# EAGLE design microNrf (EAGLE 9.6.2)
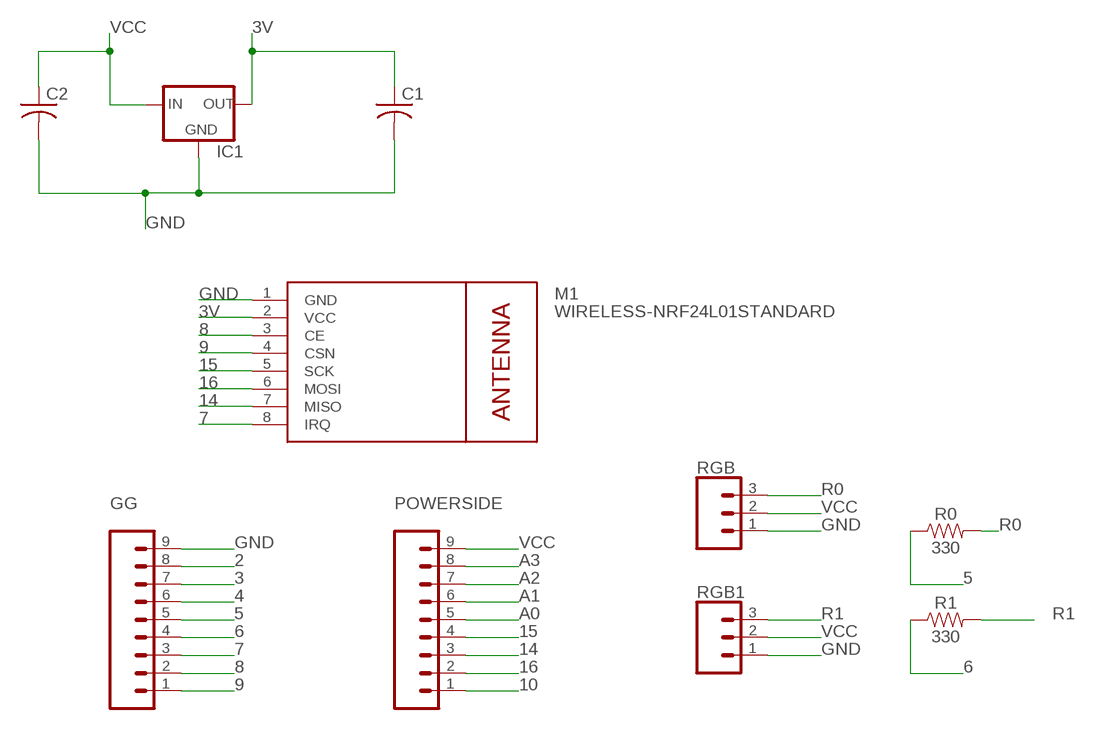
[diagram p0: schematic, sheet 1]

## Parts
C1  C-US025-030X050  [C025-030X050]
C2  C-US025-030X050  [C025-030X050]
GG  CONN_09  [1X09]
IC1  MCP1700TRI  [TO92]
M1  WIRELESS-NRF24L01STANDARD  [WIRELESS-NRF24L01]
POWERSIDE  CONN_09  [1X09]
R0  330  330OHM-0603-1/10W-1%  [0603]
R1  330  330OHM-0603-1/10W-1%  [0603]
RGB  CONN_03LONGPADS  [1X03_LONGPADS]
RGB1  CONN_03LONGPADS  [1X03_LONGPADS]

## Nets
2: GG.8
3: GG.7
3V: C1.1 IC1.3(OUT) M1.2(VCC)
4: GG.6
5: GG.5 R0.1
6: GG.4 R1.1
7: GG.3 M1.8(IRQ)
8: GG.2 M1.3(CE)
9: GG.1 M1.4(CSN)
10: POWERSIDE.1
14: M1.7(MISO) POWERSIDE.3
15: M1.5(SCK) POWERSIDE.4
16: M1.6(MOSI) POWERSIDE.2
A0: POWERSIDE.5
A1: POWERSIDE.6
A2: POWERSIDE.7
A3: POWERSIDE.8
GND: C1.2 C2.2 GG.9 IC1.1(GND) M1.1(GND) RGB1.1 RGB.1
R0: R0.2 RGB.3
R1: R1.2 RGB1.3
VCC: C2.1 IC1.2(IN) POWERSIDE.9 RGB1.2 RGB.2

## Library data of the parts
C1 C2 = adafruit:C-US: CAPACITOR, American symbol
GG POWERSIDE = SparkFun-Connectors:CONN_09: Multi connection point. Often used as Generic Header-pin footprint for 0.1 inch spaced/style header connections On any of the 0.1 inch spaced packages, you can populate with these: Break Away Headers - Straight <https://www.sparkfun.com/products/116> (PRT-00116) Break Away Male Headers - Right Angle <https://www.sparkfun.com/products/553> (PRT-00553) Female Headers <https://www.sparkfun.com/products/115> (PRT-00115) Break Away Headers - Machine Pin <https://www.sparkfun.com/products/117> (PRT-00117) Break Away Female Headers - Swiss Machine Pin <https://www.sparkfun.com/products/743> (PRT-00743) For SCREWTERMINALS and SPRING TERMINALS visit here: Screw Terimnals on SparkFun.com <https://www.sparkfun.com/search/results?term=Screw+Terminals> (5mm/3.5mm/2.54mm spacing) This device is also useful as a general connection point to wire up your design to another part of your project. Our various solder wires solder well into these plated through hole pads. Hook-Up Wire - Assortment (Stranded, 22 AWG) <https://www.sparkfun.com/products/11375> (PRT-11375) Hook-Up Wire - Assortment (Solid Core, 22 AWG) <https://www.sparkfun.com/products/11367> (PRT-11367) View the entire wire category on our website here <https://www.sparkfun.com/categories/141> Special notes: Molex polarized connector foot print use with SKU : PRT-08231 with associated crimp pins and housings. 1MM SMD Version SKU: PRT-10208 NOTES ON THE VARIANTS LOCK and LOCK_LONGPADS... This footprint was designed to help hold the alignment of a through-hole component (i.e. 6-pin header) while soldering it into place. You may notice that each hole has been shifted either up or down by 0.005 of an inch from it's more standard position (which is a perfectly straight line). This slight alteration caused the pins (the squares in the middle) to touch the edges of the holes. Because they are alternating, it causes a "brace" to hold the component in place. 0.005 has proven to be the perfect amount of "off-center" position when using our standard breakaway headers. Although looks a little odd when you look at the bare footprint, once you have a header in there, the alteration is very hard to notice. Also,if you push a header all the way into place, it is covered up entirely on the bottom side.
IC1 = adafruit:MCP1700: VOLTAGE REGULATOR
M1 = nrf24l01plus:WIRELESS-NRF24L01: 2.4 GHz Wireless Module based on NRF24L01 chip
R0 R1 = SparkFun-Resistors:330OHM: 330Ω resistor A resistor is a passive two-terminal electrical component that implements electrical resistance as a circuit element. Resistors act to reduce current flow, and, at the same time, act to lower voltage levels within circuits. - Wikipedia; PROD_ID: RES-00818
RGB RGB1 = SparkFun-Connectors:CONN_03: Multi connection point. Often used as Generic Header-pin footprint for 0.1 inch spaced/style header connections On any of the 0.1 inch spaced packages, you can populate with these: Break Away Headers - Straight <https://www.sparkfun.com/products/116> (PRT-00116) Break Away Male Headers - Right Angle <https://www.sparkfun.com/products/553> (PRT-00553) Female Headers <https://www.sparkfun.com/products/115> (PRT-00115) Break Away Headers - Machine Pin <https://www.sparkfun.com/products/117> (PRT-00117) Break Away Female Headers - Swiss Machine Pin <https://www.sparkfun.com/products/743> (PRT-00743) Stackable Header - 3 Pin (Female, 0.1") <https://www.sparkfun.com/products/13875> (PRT-13875) For SCREWTERMINALS and SPRING TERMINALS visit here: Screw Terimnals on SparkFun.com <https://www.sparkfun.com/search/results?term=Screw+Terminals> (5mm/3.5mm/2.54mm spacing) This device is also useful as a general connection point to wire up your design to another part of your project. Our various solder wires solder well into these plated through hole pads. Hook-Up Wire - Assortment (Stranded, 22 AWG) <https://www.sparkfun.com/products/11375> (PRT-11375) Hook-Up Wire - Assortment (Solid Core, 22 AWG) <https://www.sparkfun.com/products/11367> (PRT-11367) View the entire wire category on our website here <https://www.sparkfun.com/categories/141> Special notes: Molex polarized connector foot print use with SKU : PRT-08232 with associated crimp pins and housings.

## Board
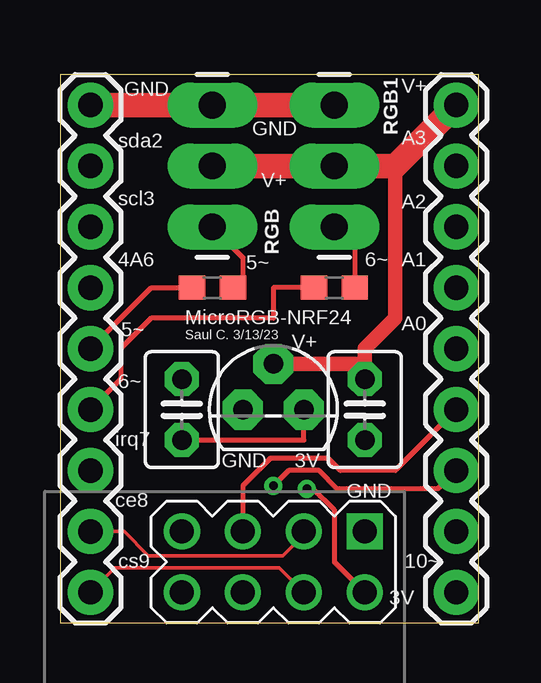
[diagram p1: board, top side]
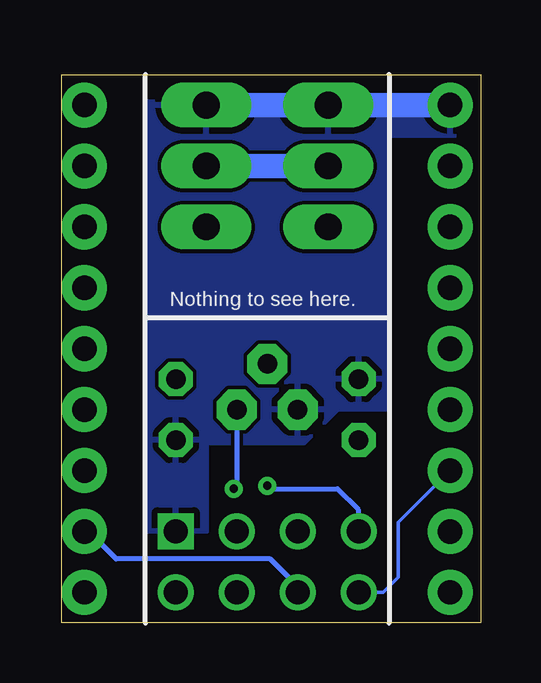
[diagram p2: board, bottom side, seen from below]

Size 17.45 x 22.85 mm. Coordinates in mm from the lower left corner, seen from the top.
Outline: 0,0 17.45,0 17.45,22.85 0,22.85 0,0
Copper layers (1*16): Top 0.035mm / dielectric 1.5mm / Bottom 0.035mm
Design rules "default": minimum track width 6mil, minimum drill 0.35mm, track to track 6mil, track to pad 6mil, pad to pad 6mil, via to via 6mil, smd to smd 6mil, copper to edge 40mil, drill to drill 6mil, minimum pad ring 10mil, minimum via ring 8mil, stop-mask expansion 4mil, vias tented up to drill 0mil, thermal gap 10mil

### Footprints (pad centres in the part's own frame; a part is rotated, then mirrored left to right if it is on the bottom)
C025-030X050 = drill 0.813 pad 1.422 octagon: 1 -1.27,0; 2 1.27,0
1X09 = drill 1.016 pad 1.88: 1 0,0; 2 2.54,0; 3 5.08,0; 4 7.62,0; 5 10.16,0; 6 12.7,0; 7 15.24,0; 8 17.78,0; 9 20.32,0
TO92 = drill 0.813 pad 1.676 octagon: 1 -1.27,0; 2 0,1.905; 3 1.27,0
WIRELESS-NRF24L01 = drill 1 square: 1 -12.7,6.35 | drill 1: 2 -10.16,6.35; 3 -12.7,3.81; 4 -10.16,3.81; 5 -12.7,1.27; 6 -10.16,1.27; 7 -12.7,-1.27; 8 -10.16,-1.27
0603 = smd 1.1 x 1: 1 -0.85,0; 2 0.85,0
1X03_LONGPADS = drill 1.118 pad 1.88 long: 1 0,0; 2 2.54,0; 3 5.08,0

### Placement (x,y rotation side)
C1  5.08,8.89 90 top
C2  12.7,8.89 270 top
GG  1.27,1.27 90 top
IC1  8.89,8.89 0 top
M1  6.35,-8.89 270 top
POWERSIDE  16.51,1.27 90 top
R0  6.35,13.97 0 top
R1  11.43,13.97 0 top
RGB  6.35,21.59 270 top
RGB1  11.43,21.59 270 top

### Tracks (layer width: path | path; a pad name or v marks a point on that pad's centre or on a via)
3V  (via drill 0.35)
  Top 0.203: C1.1 10.16,7.62 IC1.3 | M1.2 11.43,2.54 11.43,4.7 10.54,5.59 v10.29,5.59
  Bottom 0.203: IC1.3 10.16,5.71 v10.29,5.59
5
  Top 0.203: GG.5 3.81,13.97 R0.1
6
  Top 0.203: R1.1 8.89,13.97 8.89,12.7 3.81,12.7 2.54,11.43 2.54,10.16 GG.4
7
  Bottom 0.152: GG.3 3.43,4.19 3.43,1.91 4.06,1.27 M1.8
8
  Top 0.152: GG.2 2.67,3.81 3.68,2.79 9.27,2.79 10.16,3.68 M1.3
9
  Top 0.152: M1.4 9.14,2.29 2.29,2.29 GG.1
14  (via drill 0.35)
  Top 0.203: POWERSIDE.3 15.75,5.59 11.56,5.59 10.79,6.35 9.53,6.35 v8.89,5.71
  Bottom 0.203: M1.7 5.08,4.7 5.97,5.59 8.76,5.59 v8.89,5.71
15
  Top 0.203: M1.5 7.62,5.71 8.76,6.86 11.18,6.86 11.68,6.35 13.97,6.35 POWERSIDE.4
16
  Bottom 0.203: M1.6 7.62,1.52 8.76,2.67 15.19,2.67 16.33,3.81 POWERSIDE.2
GND
  Top 1.016: RGB1.1 RGB.1 GG.9
  Bottom 1.016: RGB1.1 RGB.1 GG.9
  pour Bottom: -1.27,24.13 -1.27,20.32 3.81,20.32 3.81,8.89 5.97,8.89 7.37,7.49 11.43,7.49 11.43,3.81 13.97,3.81 13.97,24.13
R0
  Top 0.203: RGB.3 7.62,15.24 7.62,14.39 R0.2
R1
  Top 0.203: RGB1.3 12.28,15.66 R1.2
VCC
  Top 0.203: 8.89,19.05 13.97,19.05
  Top 0.61: IC1.2 12.7,10.79 C2.1 12.7,11.43 13.97,12.7 13.97,19.05
  Top 1.016: RGB.2 8.89,19.05 RGB1.2 13.97,19.05 POWERSIDE.9
  Bottom 1.016: RGB.2 RGB1.2

### Text on the board
tPlace: GND | V+ | sda2 | GND | A3 | V+ | scl3 | A2 | 4A6 | 5~ | 6~ | A1 | 5~ | MicroRGB-NRF24 | Saul C. 3/13/23 | A0 | V+ | 6~ | irq7 | GND | 3V | ce8 | GND | cs9 | 10~ | 3V
bPlace: Nothing to see here.